# EAGLE schematic CR1000X MUX (EAGLE 9.6.2)
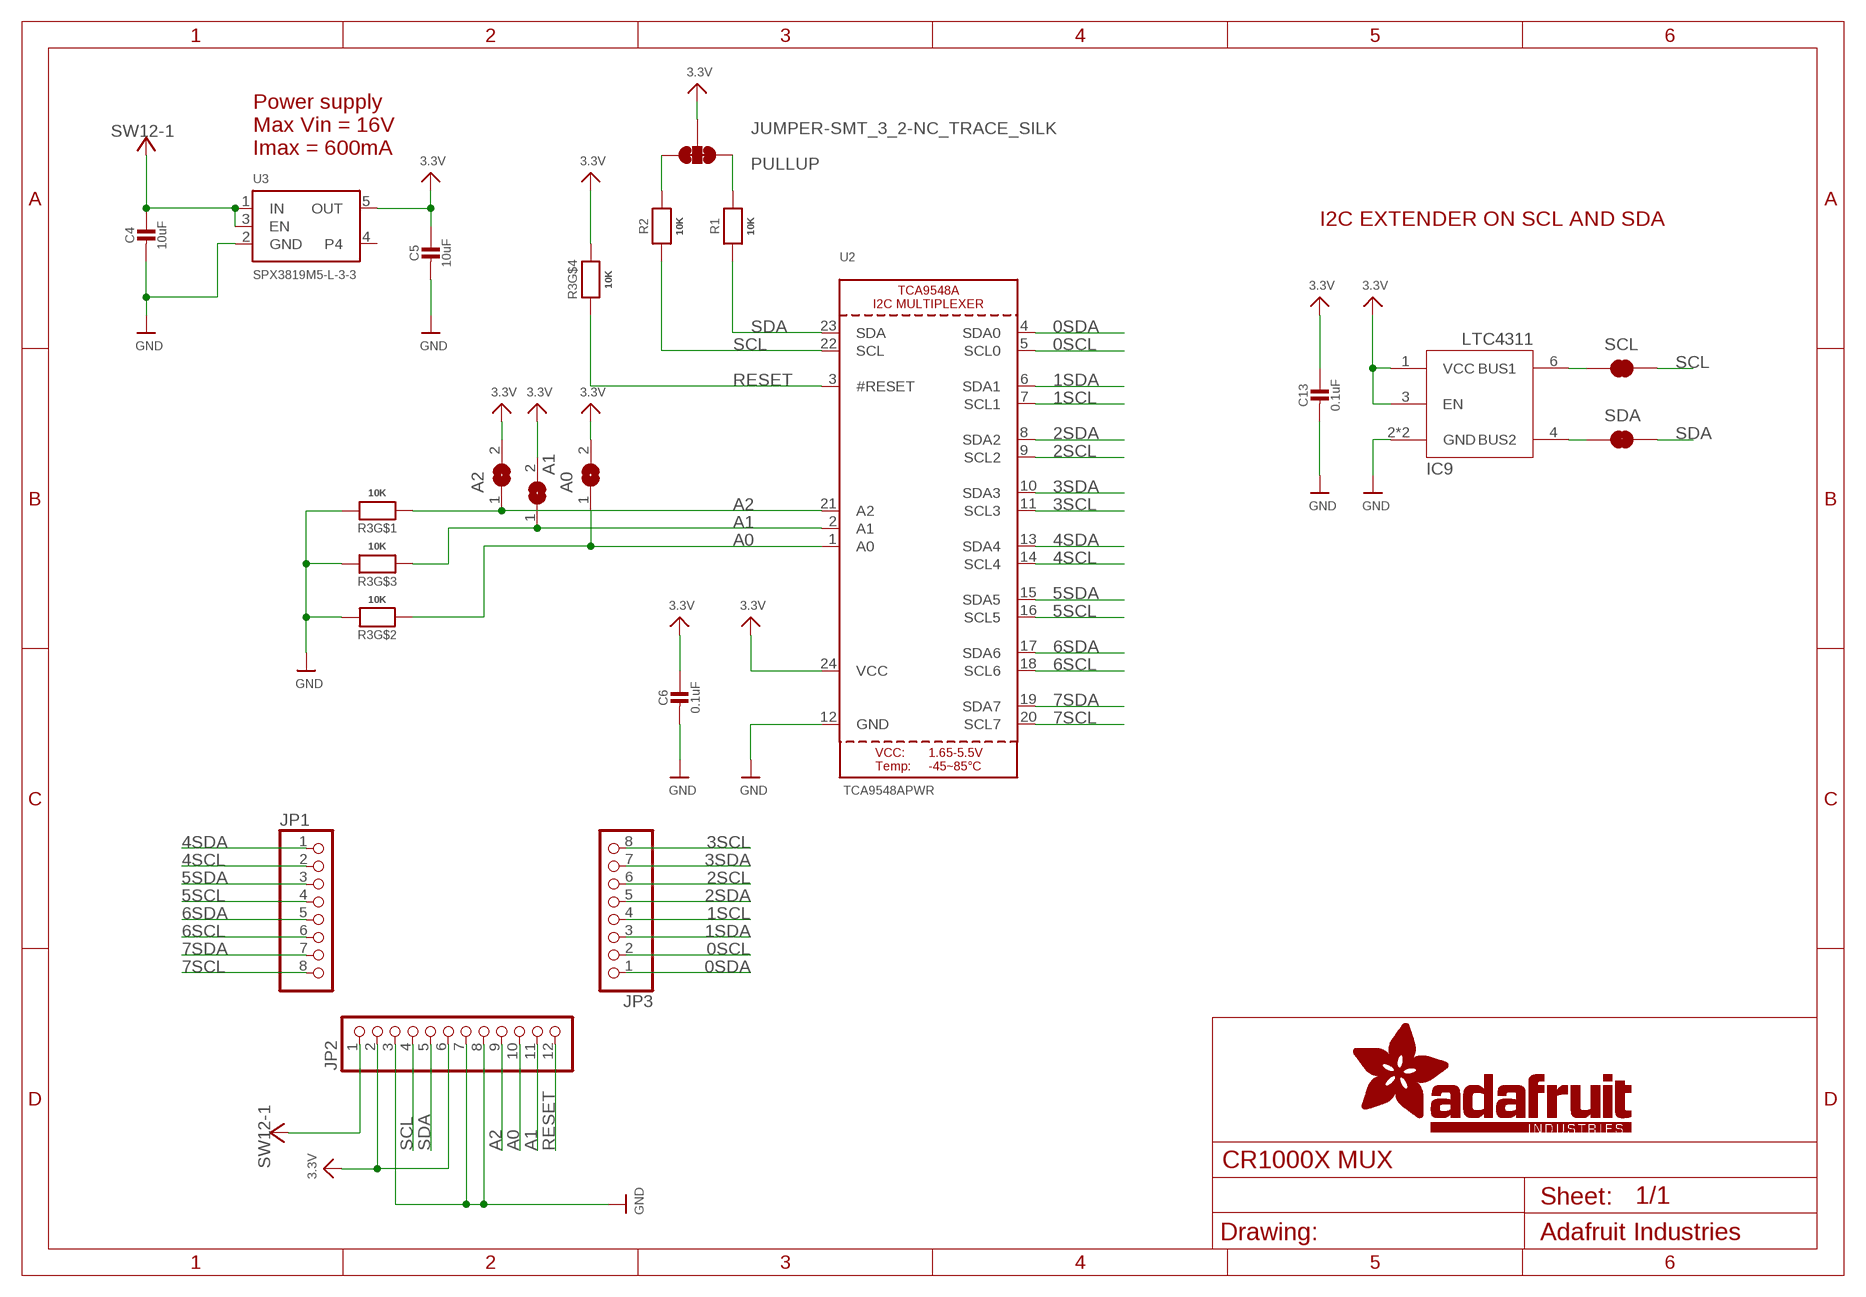
[diagram p0: schematic, sheet 1, part 1 of 2]
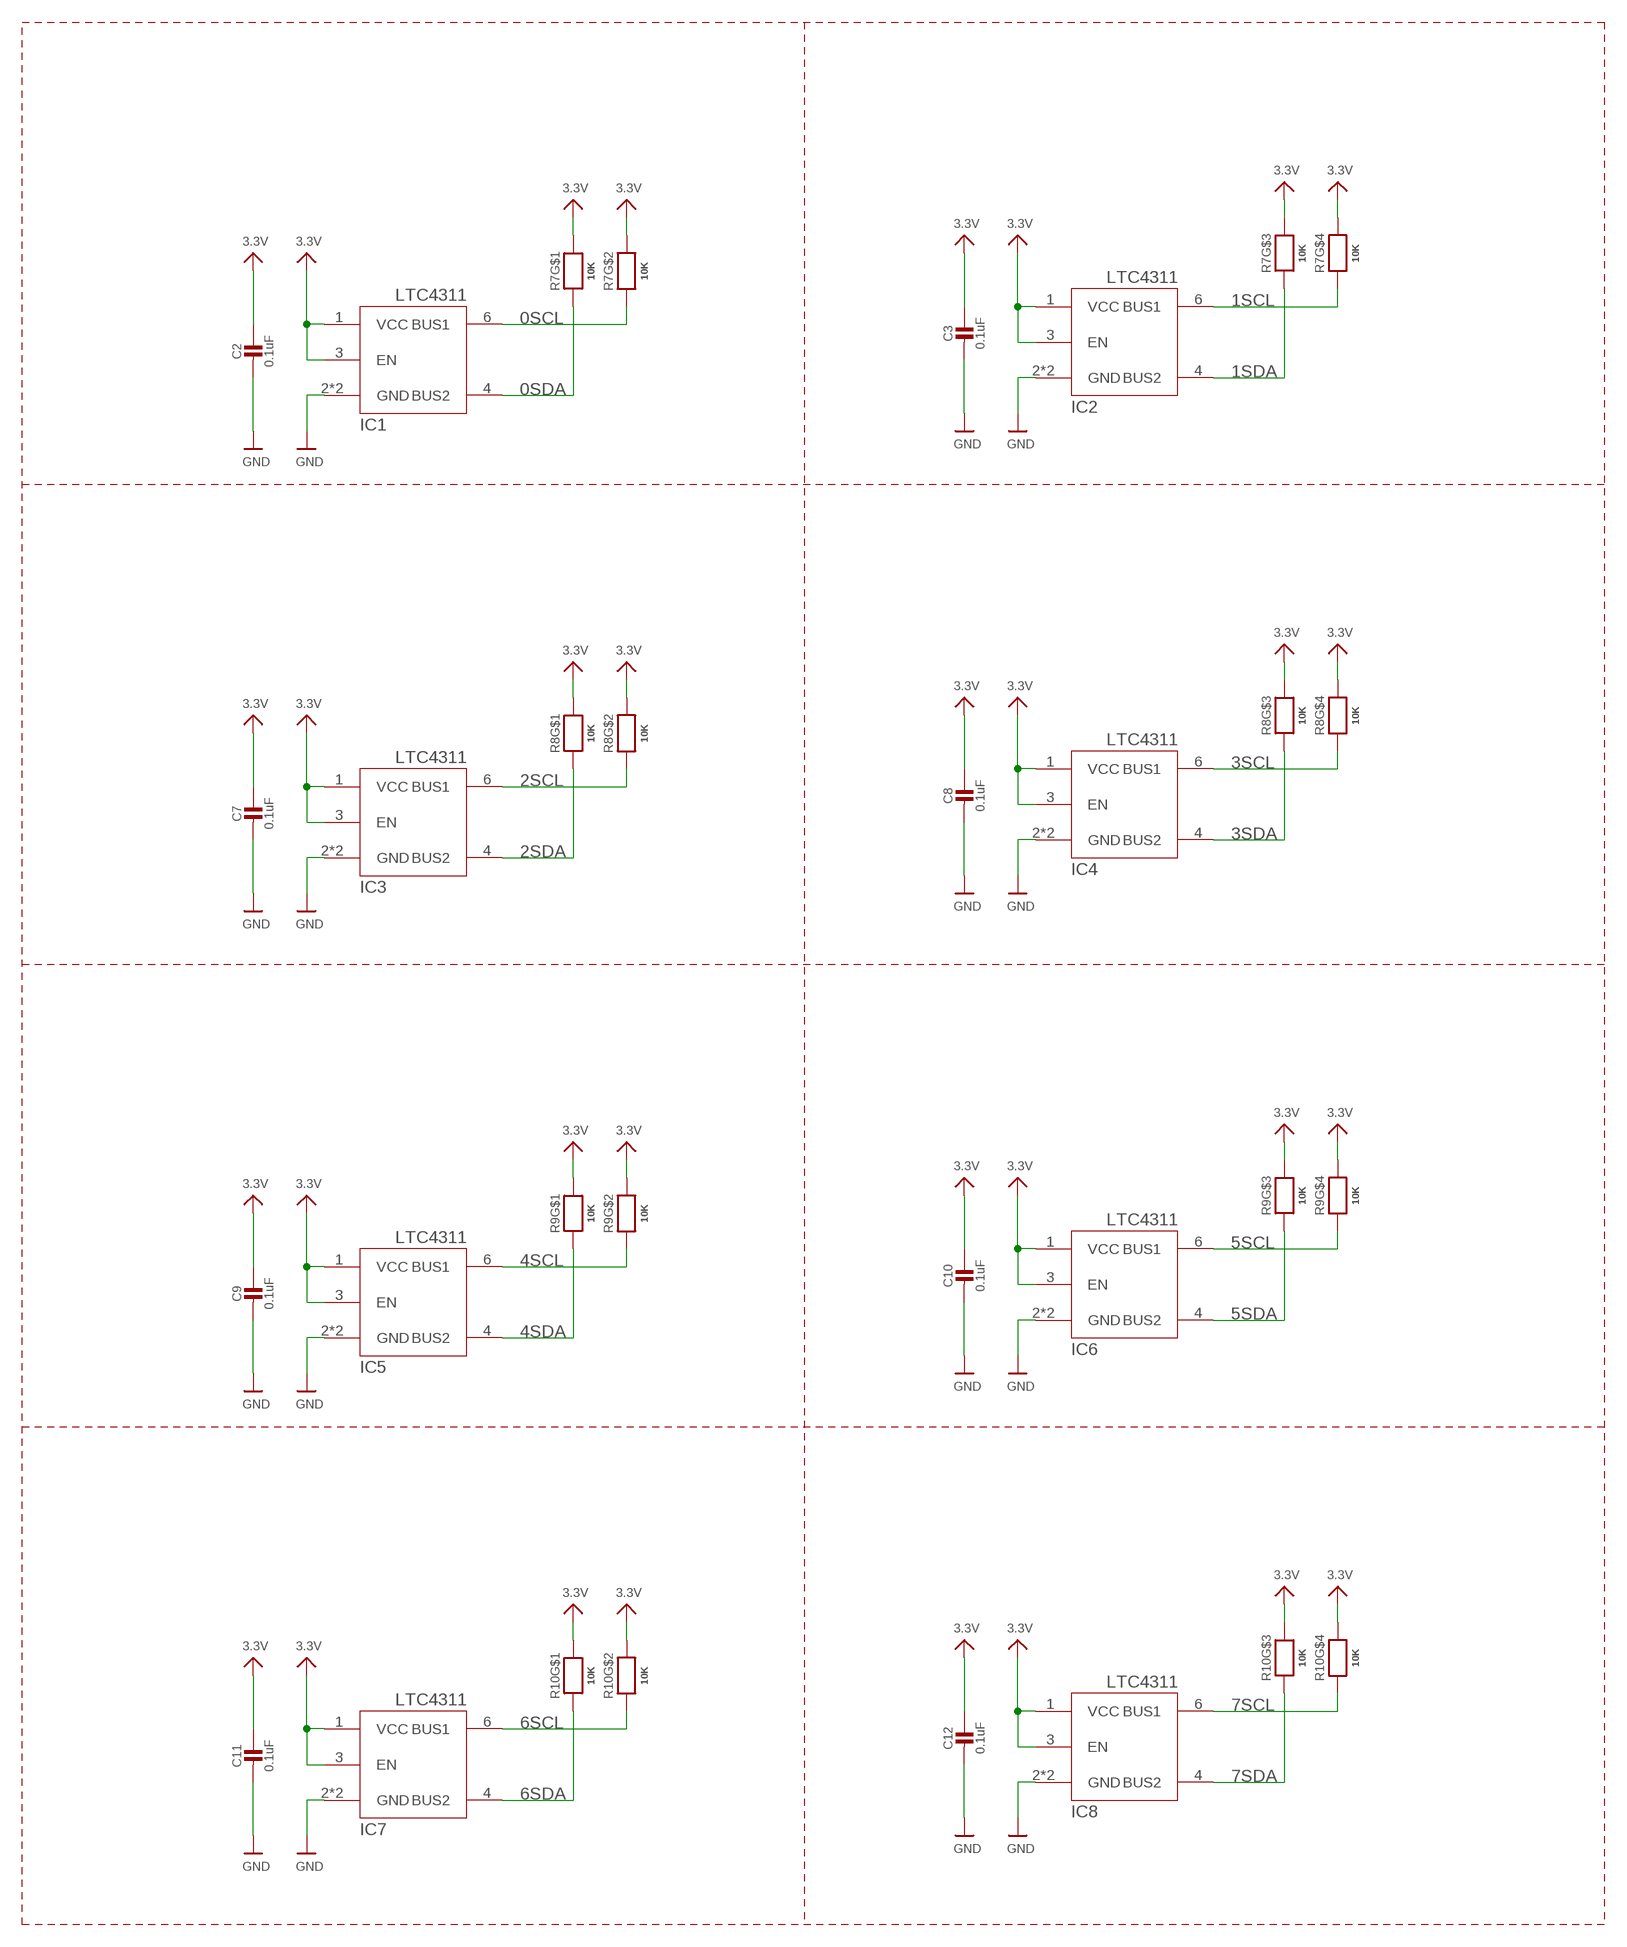
[diagram p1: schematic, sheet 1, part 2 of 2]

## Parts
A0  SOLDERJUMPER  [SOLDERJUMPER_ARROW_NOPASTE]
A1  SOLDERJUMPER  [SOLDERJUMPER_ARROW_NOPASTE]
A2  SOLDERJUMPER  [SOLDERJUMPER_ARROW_NOPASTE]
C2  0.1uF  CAP_CERAMIC0603_NO  [0603-NO]
C3  0.1uF  CAP_CERAMIC0603_NO  [0603-NO]
C4  10uF  CAP_CERAMIC0805-NOOUTLINE  [0805-NO]
C5  10uF  CAP_CERAMIC0805-NOOUTLINE  [0805-NO]
C6  0.1uF  CAP_CERAMIC0603_NO  [0603-NO]
C7  0.1uF  CAP_CERAMIC0603_NO  [0603-NO]
C8  0.1uF  CAP_CERAMIC0603_NO  [0603-NO]
C9  0.1uF  CAP_CERAMIC0603_NO  [0603-NO]
C10  0.1uF  CAP_CERAMIC0603_NO  [0603-NO]
C11  0.1uF  CAP_CERAMIC0603_NO  [0603-NO]
C12  0.1uF  CAP_CERAMIC0603_NO  [0603-NO]
C13  0.1uF  CAP_CERAMIC0603_NO  [0603-NO]
IC1  LTC4311_SC70  [SC70-6L]
IC2  LTC4311_SC70  [SC70-6L]
IC3  LTC4311_SC70  [SC70-6L]
IC4  LTC4311_SC70  [SC70-6L]
IC5  LTC4311_SC70  [SC70-6L]
IC6  LTC4311_SC70  [SC70-6L]
IC7  LTC4311_SC70  [SC70-6L]
IC8  LTC4311_SC70  [SC70-6L]
IC9  LTC4311_SC70  [SC70-6L]
JP1  PINHD-1X8BIG  [1X08-BIG]
JP2  HEADER-1X12  [1X12_ROUND]
JP3  PINHD-1X8BIG  [1X08-BIG]
PULLUP  JUMPER-SMT_3_2-NC_TRACE_SILK  [SMT-JUMPER_3_2-NC_TRACE_SILK]
R1  10K  RESISTOR0805_NOOUTLINE  [0805-NO@1]
R2  10K  RESISTOR0805_NOOUTLINE  [0805-NO@1]
R3  10K  RESISTOR_4PACK  [RESPACK_4X0603]
R7  10K  RESISTOR_4PACK  [RESPACK_4X0603]
R8  10K  RESISTOR_4PACK  [RESPACK_4X0603]
R9  10K  RESISTOR_4PACK  [RESPACK_4X0603]
R10  10K  RESISTOR_4PACK  [RESPACK_4X0603]
SCL  JUMPER-SMT_2_NC_TRACE_SILK  [SMT-JUMPER_2_NC_TRACE_SILK]
SDA  JUMPER-SMT_2_NC_TRACE_SILK  [SMT-JUMPER_2_NC_TRACE_SILK]
U2  TCA9548APWR  TCA9548A  [TSSOP24]
U3  SPX3819M5-L-3-3  VREG_SOT23-5  [SOT23-5]

## Nets
0SCL: IC1.6(BUS1) JP3.2 R7.7 U2.5(SCL0)
0SDA: IC1.4(BUS2) JP3.1 R7.8 U2.4(SDA0)
1SCL: IC2.6(BUS1) JP3.4 R7.5 U2.7(SCL1)
1SDA: IC2.4(BUS2) JP3.3 R7.6 U2.6(SDA1)
2SCL: IC3.6(BUS1) JP3.6 R8.7 U2.9(SCL2)
2SDA: IC3.4(BUS2) JP3.5 R8.8 U2.8(SDA2)
3.3V [lowpower]: A0.2 A1.2 A2.2 C2.1 C3.1 C5.1 C6.1 C7.1 C8.1 C9.1 C10.1 C11.1 C12.1 C13.1 IC1.1(VCC) IC1.3(EN) IC2.1(VCC) IC2.3(EN) IC3.1(VCC) IC3.3(EN) IC4.1(VCC) IC4.3(EN) IC5.1(VCC) IC5.3(EN) IC6.1(VCC) IC6.3(EN) IC7.1(VCC) IC7.3(EN) IC8.1(VCC) IC8.3(EN) IC9.1(VCC) IC9.3(EN) JP2.2 JP2.6 PULLUP.2 R3.4 R7.1 R7.2 R7.3 R7.4 R8.1 R8.2 R8.3 R8.4 R9.1 R9.2 R9.3 R9.4 R10.1 R10.2 R10.3 R10.4 U2.24(VCC) U3.5(OUT)
3SCL: IC4.6(BUS1) JP3.8 R8.5 U2.11(SCL3)
3SDA: IC4.4(BUS2) JP3.7 R8.6 U2.10(SDA3)
4SCL: IC5.6(BUS1) JP1.2 R9.7 U2.14(SCL4)
4SDA: IC5.4(BUS2) JP1.1 R9.8 U2.13(SDA4)
5SCL: IC6.6(BUS1) JP1.4 R9.5 U2.16(SCL5)
5SDA: IC6.4(BUS2) JP1.3 R9.6 U2.15(SDA5)
6SCL: IC7.6(BUS1) JP1.6 R10.7 U2.18(SCL6)
6SDA: IC7.4(BUS2) JP1.5 R10.8 U2.17(SDA6)
7SCL: IC8.6(BUS1) JP1.8 R10.5 U2.20(SCL7)
7SDA: IC8.4(BUS2) JP1.7 R10.6 U2.19(SDA7)
A0: A0.1 JP2.10 R3.7 U2.1(A0)
A1: A1.1 JP2.11 R3.6 U2.2(A1)
A2: A2.1 JP2.9 R3.8 U2.21(A2)
GND [highpower]: C2.2 C3.2 C4.2 C5.2 C6.2 C7.2 C8.2 C9.2 C10.2 C11.2 C12.2 C13.2 IC1.2(GND) IC1.5(GND) IC2.2(GND) IC2.5(GND) IC3.2(GND) IC3.5(GND) IC4.2(GND) IC4.5(GND) IC5.2(GND) IC5.5(GND) IC6.2(GND) IC6.5(GND) IC7.2(GND) IC7.5(GND) IC8.2(GND) IC8.5(GND) IC9.2(GND) IC9.5(GND) JP2.3 JP2.7 JP2.8 R3.1 R3.2 R3.3 U2.12(GND) U3.2(GND)
N$1: PULLUP.3 R2.2
N$2: PULLUP.1 R1.2
N$5: IC9.6(BUS1) SCL.1
N$6: IC9.4(BUS2) SDA.1
RESET: JP2.12 R3.5 U2.3(#RESET)
SCL: JP2.4 R2.1 SCL.2 U2.22(SCL)
SDA: JP2.5 R1.1 SDA.2 U2.23(SDA)
SW12-1: C4.1 JP2.1 U3.1(IN) U3.3(EN)
Unconnected: U3.4

## Notes on the sheet
- Power supply
  Max Vin = 16V
  Imax = 600mA
- I2C EXTENDER ON SCL AND SDA

## Library data of the parts
A0 A1 A2 = microbuilder:SOLDERJUMPER: SMD Solder JUMPER Solder the two pads together to create a connection, or remove the solder to break it. REFLOW - Use this footprint for solder paste and reflow ovens. WAVE - Use this footprint for hand-soldering (larger pads). CLOSED - Has a trace between the two pads to ensure it is closed by default. The trace needs to be cut to disable the jumper, and can be closed again by creating a solder bridge between the two pads.; BOM: EXCLUDE
C2-C13 = microbuilder:CAP_CERAMIC: Ceramic Capacitors For new designs, use the packages preceded by an '_' character since they are more reliable: The following footprints should be used on most boards: _0402 - Standard footprint for regular board layouts _0603 - Standard footprint for regular board layouts _0805 - Standard footprint for regular board layouts _1206 - Standard footprint for regular board layouts For extremely tight-pitch boards where space is at a premium, the following 'micro-pitch' footprints can be used (smaller pads, no silkscreen outline, etc.): _0402MP - Micro-pitch footprint for very dense/compact boards _0603MP - Micro-pitch footprint for very dense/compact boards _0805MP - Micro-pitch footprint for very dense/compact boards _1206MP - Micro-pitch footprint for very dense/compact boards
IC1-IC9 = microbuilder:LTC4311
JP1 JP3 = adafruit:PINHD-1X8: PIN HEADER
JP2 = microbuilder:HEADER-1X12
PULLUP = SparkFun-Jumpers:JUMPER-SMT_3_2-NC_TRACE: Normally closed trace jumper (2 of 2 connections) This jumper has a trace between all three pads so they are normally closed (NC). Use a razor knife to open the connection(s). For best results follow the IPC guidelines for cutting traces: Cutout at least 0.063 mm (0.005 in). Remove all loose material to clean up the cut area. Seal the cut with an approved epoxy. Reapply solder to reclose the connection(s).
R1 R2 = microbuilder:RESISTOR: Resistors For new designs, use the packages preceded by an '_' character since they are more reliable: The following footprints should be used on most boards: _0402 - Standard footprint for regular board layouts _0603 - Standard footprint for regular board layouts _0805 - Standard footprint for regular board layouts _1206 - Standard footprint for regular board layouts For extremely tight-pitch boards where space is at a premium, the following 'micro-pitch' footprints can be used (smaller pads, no silkscreen outline, etc.): _0402MP - Micro-pitch footprint for very dense/compact boards _0603MP - Micro-pitch footprint for very dense/compact boards _0805MP - Micro-pitch footprint for very dense/compact boards _1206MP - Micro-pitch footprint for very dense/compact boards
R3 R7-R10 = microbuilder:RESISTOR_4PACK: Resistor Packs (4 resistors) 4 x 0603 10K 1/16W - Digikey: YC164J-10KCT-ND
SCL SDA = SparkFun-Jumpers:JUMPER-SMT_2_NC_TRACE: Normally closed trace jumper This jumper has a trace between two pads so it's normally closed (NC). Use a razor knife to open the connection. For best results follow the IPC guidelines for cutting traces: Cutout at least 0.063 mm (0.005 in). Remove all loose material to clean up the cut area. Seal the cut with an approved epoxy. Reapply solder to reclose the connection.
U2 = microbuilder:TCA9548A: TCA9548A I2C Multiplexer
U3 = microbuilder:VREG_SOT23-5: SOT23-5 Fixed Voltage Regulators Part Current Out V Out V In V Dropout θJA (°C/W) TJ (°C) Digikey Part No. ADP121 150mA 3.3V 3.4-5.5V 0.09V @ 150mA -- -- ADP121-AUJZ33R7CT-ND ADP121 150mA 3.0V 3.1-5.5V 0.09V @ 150mA -- -- ADP121-AUJZ30R7CT-ND ADP122 300mA 3.3V 3.4-5.5V 0.085V @ 300mA -- -- ADP122AUJZ-3.3-R7CT-ND ADP1712 300mA 3.3V 3.5-5.5V 0.17V @ 300mA -- -- ADP1712AUJZ-3.3-R7TR-ND AP7311 (Low Cost) 150mA 3.3V 3.5-6V 0.15V @ 150mA -- -- AP7311-33WG-7DICT-ND LD39015M18R 150mA 1.8V 1.9V-5.5V 0.08V @ 100mA -- -- 497-6977-1-ND LP2985A-33DBVR 150mA 3.3V 3.3-16V 0.28V @ 150mA 206 150 296-18479-1-ND MCP1824T-3302E/OT 300mA 3.3V 3.5V-6V 0.2V @ 300mA -- -- MCP1824T-3302E/OTCT-ND MIC5205-2.5YM5 TR 150mA 2.5V 2.7-16V 0.165V @ 150mA -- -- 576-1257-2-ND MIC5205-3.0YM5 TR 150mA 3.0V 3.2V-16V 0.165V @ 150mA -- -- 576-1258-2-ND MIC5205-3.3YM5 TR 150mA 3.3V 3.5V-16V 0.165V @ 150mA -- -- 576-1259-2-ND TPS780330220 150mA 3.3V+2.2V 3.6-5.5V 250mV Max -- -- 296-23332-1-ND TDA3663/N1,135 100mA 3.3V 3.5-45V 0.18V @ 50mA -- -- 568-5343-1-ND Max operating temp can be calculated using θJA, TJ (max junction temperature), and power in watts. Set the "Maximum Ambient Temperature" until it reaches TJ ("Max Junction Temperature"), which is the absolute limit for safe use of the regulator: Heat Sink Temperature Calculator <http://www.daycounter.com/Calculators/Heat-Sink-Temperature-Calculator.phtml> For example, With 12V source into a 3.3V LP2985 and a 30mA load, we are dissipating (12V-3.3V) * 0.03A = 0.261W. With a θJA of 206 °C/W, a TJ of 150°C, and 261mW we can safely use the chip without a heat sink up to 75°C (=147.1°C Junction Temperature).

## Net classes
1 highpower: width 0.305 mm, drill 0.483 mm
2 lowpower: width 0.254 mm, drill 0.483 mm